# Altium schematic sheet deel3_processor.SchDoc
size A4; SheetNumber: 3; SheetTotal: 5
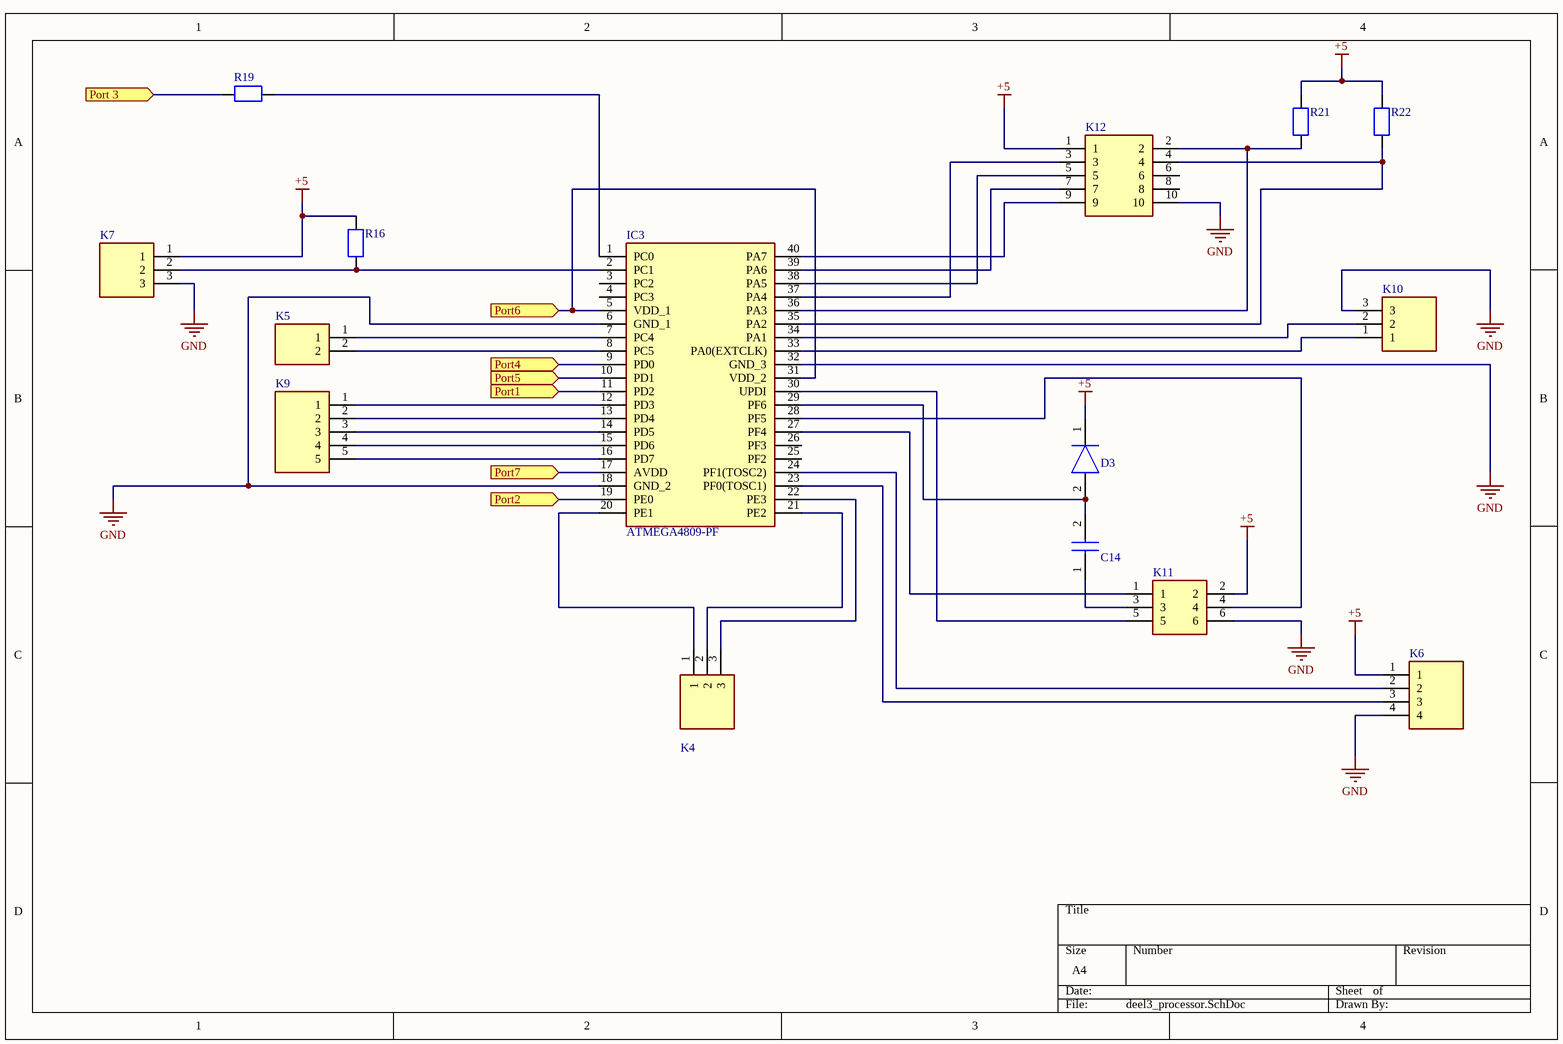
[diagram p0: deel3_processor.SchDoc]

## Parts
C14  08055A130JAT2A  [CAPC2012X94N]  (value not drawn)
D3  1N4148  [DIOAD1165W56L425D185]  (value not drawn)
IC3  ATMEGA4809-PF  [DIP1543W58P254L5175H635Q40N]
K4  10129378-903001BLF  [HDRV3W67P0X254_1X3_762X241X858P]  (value not drawn)
K5  10129378-902001BLF  [HDRV2W67P0X254_1X2_508X241X843P]  (value not drawn)
K6  10129378-904001BLF  [HDRV4W67P0X254_1X4_1270X241X858P]  (value not drawn)
K7  10129378-903001BLF  [HDRV3W67P0X254_1X3_762X241X858P]  (value not drawn)
K9  10129378-905001BLF  [HDRV5W67P0X254_1X5_1270X241X858P]  (value not drawn)
K10  10129378-903001BLF  [HDRV3W67P0X254_1X3_762X241X858P]  (value not drawn)
K11  10129381-906002BLF  [HDRV6W67P254_2X3_762X483X858P]  (value not drawn)
K12  N2510-6002RB  [SHDR10W64P254_2X5_2002X859X991P]  (value not drawn)
R16  CRCW08050000Z0EA  [RESC2013X50X30LL20T20]  (value not drawn)
R19  CRCW08050000Z0EA  [RESC2013X50X30LL20T20]  (value not drawn)
R21  CRCW08050000Z0EA  [RESC2013X50X30LL20T20]  (value not drawn)
R22  CRCW08050000Z0EA  [RESC2013X50X30LL20T20]  (value not drawn)

## Ports
Port1 (in), Port2 (in), Port4 (in), Port5 (in), Port6 (in), Port7 (in), Port 3 (in)

## Nets
+5: D3.1(K) K6.1 K7.1 K11.2 K12.1 R16.2 R21.2 R22.2
GND: IC3.6(GND_1) IC3.18(GND_2) IC3.32(GND_3) K6.4 K7.3 K10.3 K11.6 K12.10
Port1: IC3.11(PD2) ; port Port1
Port2: IC3.19(PE0) ; port Port2
Port4: IC3.9(PD0) ; port Port4
Port5: IC3.10(PD1) ; port Port5
Port6: IC3.5(VDD_1) IC3.31(VDD_2) ; port Port6
Port7: IC3.17(AVDD) ; port Port7
Port 3: R19.1 ; port Port 3
NetC14_1: C14.1 K11.3
NetC14_2: C14.2 D3.2(A) IC3.29(PF6)
NetIC3_1: IC3.1(PC0) R19.2
NetIC3_2: IC3.2(PC1) K7.2 R16.1
NetIC3_7: IC3.7(PC4) K5.1
NetIC3_8: IC3.8(PC5) K5.2
NetIC3_12: IC3.12(PD3) K9.1
NetIC3_13: IC3.13(PD4) K9.2
NetIC3_14: IC3.14(PD5) K9.3
NetIC3_15: IC3.15(PD6) K9.4
NetIC3_16: IC3.16(PD7) K9.5
NetIC3_20: IC3.20(PE1) K4.1
NetIC3_21: IC3.21(PE2) K4.2
NetIC3_22: IC3.22(PE3) K4.3
NetIC3_23: IC3.23(PF0(TOSC1)) K6.3
NetIC3_24: IC3.24(PF1(TOSC2)) K6.2
NetIC3_27: IC3.27(PF4) K11.1
NetIC3_28: IC3.28(PF5) K11.4
NetIC3_30: IC3.30(UPDI) K11.5
NetIC3_33: IC3.33(PA0(EXTCLK)) K10.1
NetIC3_34: IC3.34(PA1) K10.2
NetIC3_35: IC3.35(PA2) K12.4 R22.1
NetIC3_36: IC3.36(PA3) K12.2 R21.1
NetIC3_37: IC3.37(PA4) K12.3
NetIC3_38: IC3.38(PA5) K12.5
NetIC3_39: IC3.39(PA6) K12.7
NetIC3_40: IC3.40(PA7) K12.9

Not connected (* = marked no-connect by the designer): IC3 3(PC2) 4(PC3) 25(PF2) 26(PF3); K12 6 8

## Library data of the parts
C14 = 08055A130JAT2A: Capacitor; Manufacturer_Name: AVX; Datasheet Link: https://componentsearchengine.com/Datasheets/1/06031A100FAT2A.pdf; Height: 0.94mm; Manufacturer_Part_Number: 08055A130JAT2A; Mouser Part Number: 581-08055A130JAT2A; Mouser Price/Stock: https://www.mouser.com/Search/Refine.aspx?Keyword=581-08055A130JAT2A
D3 = 1N4148: Diode; Manufacturer_Name: Nexperia; Datasheet Link: https://datasheet.datasheetarchive.com/originals/distributors/Datasheets-112/DSAP0040891.pdf; Manufacturer_Part_Number: 1N4148
IC3 = ATMEGA4809-PF: Integrated Circuit; Manufacturer_Name: Microchip; Datasheet Link: http://ww1.microchip.com/downloads/en/DeviceDoc/40-pin-Data-Sheet-megaAVR-0-series-DS40002104A.pdf; Height: 6.35mm; Manufacturer_Part_Number: ATMEGA4809-PF; Mouser Part Number: 556-ATMEGA4809-PF; Mouser Price/Stock: https://www.mouser.co.uk/ProductDetail/Microchip-Technology-Atmel/ATMEGA4809-PF?qs=T3oQrply3y9UlpZbCygk%252BQ%3D%3D
K4 K7 K10 = 10129378-903001BLF: Connector; Manufacturer_Name: Amphenol; Datasheet Link: https://www.mouser.com/datasheet/2/18/10129378-1530218.pdf; Height: 8.58mm; Manufacturer_Part_Number: 10129378-903001BLF; Mouser Part Number: 649-1012937890301BLF; Mouser Price/Stock: https://www.mouser.co.uk/ProductDetail/Amphenol-FCI/10129378-903001BLF?qs=0lQeLiL1qybuYTJnitumiA%3D%3D; Arrow Part Number: 10129378-903001BLF; Arrow Price/Stock: https://www.arrow.com/en/products/10129378-903001blf/amphenol-fci?region=nac
K5 = 10129378-902001BLF: Connector; Manufacturer_Name: Amphenol; Datasheet Link: https://www.mouser.co.uk/datasheet/2/18/10129378-1530218.pdf; Height: 8.43mm; Manufacturer_Part_Number: 10129378-902001BLF; Mouser Part Number: 649-1012937890201BLF; Mouser Price/Stock: https://www.mouser.co.uk/ProductDetail/Amphenol-FCI/10129378-902001BLF?qs=0lQeLiL1qybv6C1q0T3%2FPw%3D%3D; Arrow Part Number: 10129378-902001BLF; Arrow Price/Stock: https://www.arrow.com/en/products/10129378-902001blf/amphenol-fci?region=nac
K6 = 10129378-904001BLF: Connector; Manufacturer_Name: Amphenol; Datasheet Link: https://cdn.amphenol-icc.com/media/wysiwyg/files/drawing/10129378.pdf; Height: 8.58mm; Manufacturer_Part_Number: 10129378-904001BLF; Mouser Part Number: 649-1012937890401BLF; Mouser Price/Stock: https://www.mouser.co.uk/ProductDetail/Amphenol-FCI/10129378-904001BLF?qs=0lQeLiL1qyYgZuNoMLioxA%3D%3D; Arrow Part Number: 10129378-904001BLF; Arrow Price/Stock: https://www.arrow.com/en/products/10129378-904001blf/amphenol-fci?region=nac
K9 = 10129378-905001BLF: Connector; Manufacturer_Name: FCI Electronics; Datasheet Link: https://cdn.amphenol-icc.com/media/wysiwyg/files/drawing/10129378.pdf; Height: 8.58mm; Manufacturer_Part_Number: 10129378-905001BLF; Mouser Part Number: 649-1012937890501BLF; Mouser Price/Stock: https://www.mouser.com/Search/Refine.aspx?Keyword=649-1012937890501BLF
K11 = 10129381-906002BLF: Connector; Manufacturer_Name: Amphenol; Datasheet Link: https://componentsearchengine.com/Datasheets/1/10129381-906002BLF.pdf; Height: 8.58mm; Manufacturer_Part_Number: 10129381-906002BLF; Mouser Part Number: 649-1012938190602BLF; Mouser Price/Stock: https://www.mouser.co.uk/ProductDetail/Amphenol-FCI/10129381-906002BLF?qs=DXv0QSHKF4zSKXKyBbBVMw%3D%3D; Arrow Part Number: 10129381-906002BLF; Arrow Price/Stock: https://www.arrow.com/en/products/10129381-906002blf/amphenol-fci?region=europe
K12 = N2510-6002RB: Connector; Manufacturer_Name: 3M; Datasheet Link: http://multimedia.3m.com/mws/media/330367O/3mtm-100-in-4-wall-hdr-rohs-lp-straightra-hitemp-ts0770.pdf?fn=TS0770.pdf; Height: 9.91mm; Manufacturer_Part_Number: N2510-6002RB; Mouser Part Number: 517-N2510-6002RB; Mouser Price/Stock: https://www.mouser.co.uk/ProductDetail/3M-Electronic-Solutions-Division/N2510-6002RB?qs=QV10cN0MjFtispGaro3M2Q%3D%3D; Arrow Part Number: N2510-6002RB; Arrow Price/Stock: https://www.arrow.com/en/products/n2510-6002-rb/3m?region=europe
R16 = resistor: 4k7; Manufacturer: Vishay Dale; Part Number: CRCW08050000Z0EA
R19 R21 R22 = resistor: Manufacturer: Vishay Dale; Part Number: CRCW08050000Z0EA